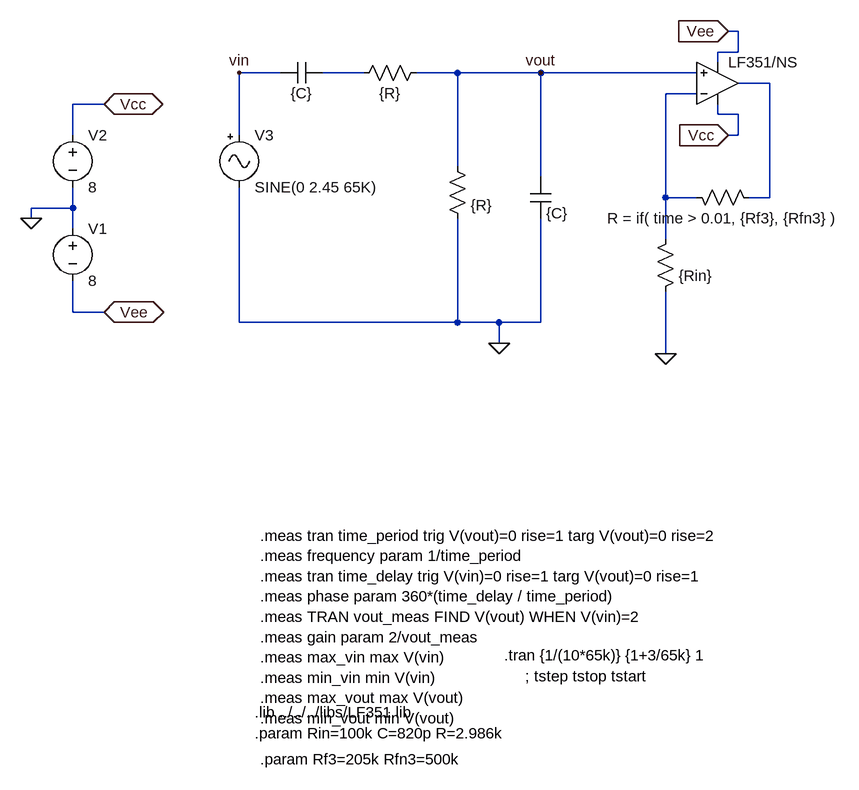
[diagram p0: schematic debugB_proj.asc]
debugB_proj.asc, the LTspice schematic file:
Version 4
SHEET 1 928 1196
WIRE 288 -16 272 -16
WIRE 288 16 288 -16
WIRE 288 16 256 16
WIRE 256 32 256 16
WIRE -416 48 -480 48
WIRE -288 48 -352 48
WIRE -144 48 -208 48
WIRE -16 48 -144 48
WIRE 224 48 -16 48
WIRE 336 64 288 64
WIRE 224 80 176 80
WIRE -688 96 -736 96
WIRE 256 112 256 96
WIRE 288 112 256 112
WIRE -736 144 -736 96
WIRE -480 144 -480 48
WIRE 288 144 288 112
WIRE 288 144 272 144
WIRE -144 192 -144 48
WIRE -16 208 -16 48
WIRE 176 240 176 80
WIRE 224 240 176 240
WIRE 336 240 336 64
WIRE 336 240 304 240
WIRE -736 256 -736 224
WIRE -736 256 -800 256
WIRE -800 272 -800 256
WIRE -736 288 -736 256
WIRE 176 304 176 240
WIRE -736 416 -736 368
WIRE -688 416 -736 416
WIRE -480 432 -480 224
WIRE -144 432 -144 272
WIRE -144 432 -480 432
WIRE -80 432 -144 432
WIRE -16 432 -16 272
WIRE -16 432 -80 432
WIRE -80 464 -80 432
WIRE 176 480 176 384
FLAG 272 144 Vcc
IOPIN 272 144 In
FLAG 272 -16 Vee
IOPIN 272 -16 In
FLAG 176 480 0
FLAG -800 272 0
FLAG -688 96 Vcc
IOPIN -688 96 BiDir
FLAG -688 416 Vee
IOPIN -688 416 BiDir
FLAG -80 464 0
FLAG -480 48 vin
FLAG -16 48 vout
SYMBOL opamp2 256 128 M180
WINDOW 0 16 32 Invisible 2
SYMATTR InstName U1
SYMATTR Value LF351/NS
SYMBOL res 320 256 M270
WINDOW 0 32 56 Invisible 2
WINDOW 3 0 56 VBottom 2
SYMATTR InstName R1
SYMATTR Value R = if( time > 0.01, {Rf3}, {Rfn3} )
SYMBOL res 160 400 M180
WINDOW 0 36 76 Invisible 2
WINDOW 3 36 40 Left 2
SYMATTR InstName R2
SYMATTR Value {Rin}
SYMBOL res -160 176 R0
WINDOW 0 36 40 Invisible 2
SYMATTR InstName R3
SYMATTR Value {R}
SYMBOL cap -32 208 R0
WINDOW 0 24 8 Invisible 2
SYMATTR InstName C1
SYMATTR Value {C}
SYMBOL res -192 32 R90
WINDOW 0 0 56 Invisible 2
WINDOW 3 32 56 VTop 2
SYMATTR InstName R4
SYMATTR Value {R}
SYMBOL cap -352 32 R90
WINDOW 0 0 32 Invisible 2
WINDOW 3 32 32 VTop 2
SYMATTR InstName C2
SYMATTR Value {C}
SYMBOL voltage -736 272 R0
SYMATTR InstName V1
SYMATTR Value 8
SYMBOL voltage -736 128 R0
SYMATTR InstName V2
SYMATTR Value 8
SYMBOL Misc/signal -480 128 R0
SYMATTR InstName V3
SYMATTR Value SINE(0 2.45 65K)
TEXT -456 1032 Left 2 !.lib ../../../libs/LF351.lib
TEXT -456 1064 Left 2 !.param Rin=100k C=820p R=2.986k
TEXT -72 944 Left 2 !.tran {1/(10*65k)} {1+3/65k} 1
TEXT -40 976 Left 2 !; tstep tstop tstart
TEXT -448 1104 Left 2 !.param Rf3=205k Rfn3=500k
TEXT -448 760 Left 2 !.meas tran time_period trig V(vout)=0 rise=1 targ V(vout)=0 rise=2\n.meas frequency param 1/time_period\n.meas tran time_delay trig V(vin)=0 rise=1 targ V(vout)=0 rise=1\n.meas phase param 360*(time_delay / time_period)\n.meas TRAN vout_meas FIND V(vout) WHEN V(vin)=2\n.meas gain param 2/vout_meas\n.meas max_vin max V(vin)\n.meas min_vin min V(vin)\n.meas max_vout max V(vout)\n.meas min_vout min V(vout)

The netlist it stands for:
* debugB_proj.asc
XU1 vout N003 Vcc Vee N002 LF351/NS  ; pins In+ In- V+ V- OUT
R1 N002 N003 R = if( time > 0.01, {Rf3}, {Rfn3} )
R2 0 N003 {Rin}
R3 vout 0 {R}
C1 vout 0 {C}
R4 vout N001 {R}
C2 N001 vin {C}
V1 0 Vee 8
V2 Vcc 0 8
V3 vin 0 SINE(0 2.45 65K)
.lib ../../../libs/LF351.lib
.param Rin=100k C=820p R=2.986k
.tran {1/(10*65k)} {1+3/65k} 1
; tstep tstop tstart
.param Rf3=205k Rfn3=500k
.meas tran time_period trig V(vout)=0 rise=1 targ V(vout)=0 rise=2
.meas frequency param 1/time_period
.meas tran time_delay trig V(vin)=0 rise=1 targ V(vout)=0 rise=1
.meas phase param 360*(time_delay / time_period)
.meas TRAN vout_meas FIND V(vout) WHEN V(vin)=2
.meas gain param 2/vout_meas
.meas max_vin max V(vin)
.meas min_vin min V(vin)
.meas max_vout max V(vout)
.meas min_vout min V(vout)
.backanno
.end